# EAGLE design Lora Soil Moisture Sensor v1.2 (EAGLE 6.1)
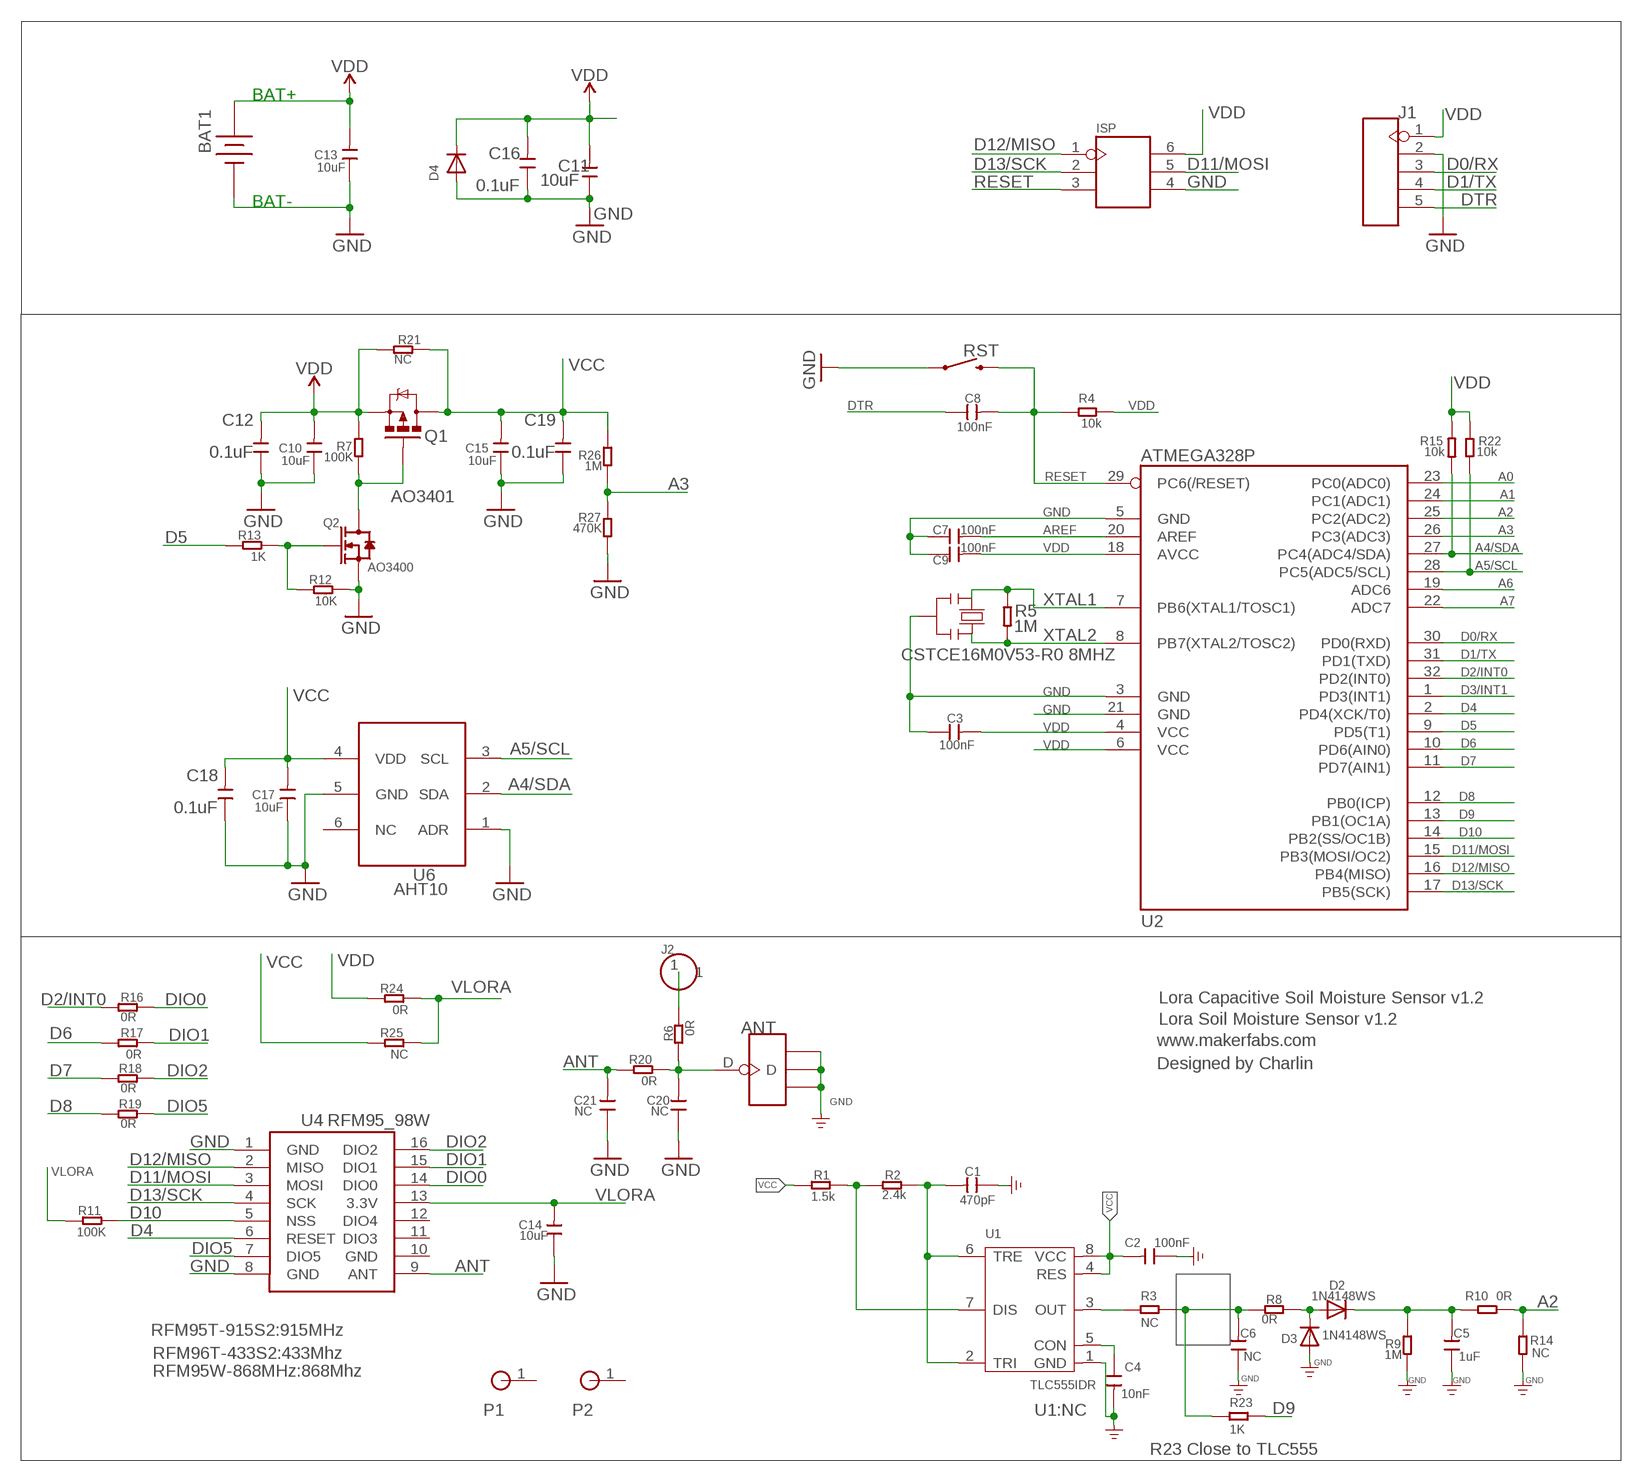
[diagram p0: schematic, sheet 1]

## Parts
ANT  ANTENNA-U-FL  [4P-U-FL]
BAT1  18650  [18650]
C1  470pF  CAP-0603  [C0603]
C2  100nF  CAP-0603  [C0603]
C3  100nF  C-0603  [0603]
C4  10nF  CAP-0603  [C0603]
C5  1uF  DISCRETE_C-0603  [DISCRETE_C0603]
C6  NC  DISCRETE_C-0603  [DISCRETE_C0603]
C7  100nF  C-0603  [0603]
C8  100nF  C-0603  [0603]
C9  100nF  C-0603  [0603]
C10  10uF  C-0603  [0603]
C11  10uF  C-0603  [0603]
C12  0.1uF  C-0603  [0603]
C13  10uF  C-0603  [0603]
C14  10uF  C-0603  [0603]
C15  10uF  C-0603  [0603]
C16  0.1uF  C-0603  [0603]
C17  10uF  C-0603  [0603]
C18  0.1uF  C-0603  [0603]
C19  0.1uF  C-0603  [0603]
C20  NC  C-0603  [0603]
C21  NC  C-0603  [0603]
D2  1N4148WS  DIODESOD-323F  [SOD-323F]
D3  1N4148WS  DIODESOD-323F  [SOD-323F]
D4  DIODESOD-323F  [SOD-323F]
ISP  HEADER-2X3P-SMD  [2X3P-2.54-SMD]
J1  HEADER-5P-2.54  [5P-2.54]
J2  HEADER-1P-50  [1P-100/50MIL]
P1  HOLE-P1-2.2  [MTGNP1-220-1MM]
P2  HOLE-P1-2.2  [MTGNP1-220-1MM]
Q1  MOSFET-PCHANNEL  [SOT23-3]
Q2  AO3400  DISCRETE_MOSFET-NSOT23  [DISCRETE_SOT23]
R1  1.5k  RES-0603  [R0603]
R2  2.4k  RES-0603  [R0603]
R3  NC  RES-0603  [R0603]
R4  10k  R-0603  [R0603]
R5  1M  R-0603  [R0603]
R6  0R  R-0603  [R0603]
R7  100K  R-0603  [R0603]
R8  0R  R-0603  [R0603]
R9  1M  R-0603  [R0603]
R10  0R  R-0603  [R0603]
R11  100K  R-0603  [R0603]
R12  10K  R-0603  [R0603]
R13  1K  R-0603  [R0603]
R14  NC  R-0603  [R0603]
R15  10k  R-0603  [R0603]
R16  0R  R-0603  [R0603]
R17  0R  R-0603  [R0603]
R18  0R  R-0603  [R0603]
R19  0R  R-0603  [R0603]
R20  0R  R-0603  [R0603]
R21  NC  R-0603  [R0603]
R22  10k  R-0603  [R0603]
R23  1K  RES-0603  [R0603]
R24  0R  R-0603  [R0603]
R25  NC  R-0603  [R0603]
R26  1M  R-0603  [R0603]
R27  470K  R-0603  [R0603]
RST  MOMENTARY-SWITCH-SPST-SMD-6.0X3.5MM  [TACTILE_SWITCH_SMD_6.0X3.5MM]
U1  TLC555IDR  CLOCK/TIMING-NE555'DR'  [SOIC8-1.27-5X4MM]
U2  ATMEGA328P  ATMEGA8/168/328  [TQFP32]
U4  RFM95_98W  RFM92_93W  [RFM92_93W]
U6  AHT10  [SMD6-127P-400L500W]
Y1  CSTCE16M0V53-R0 8MHZ  RESONATORMU  [RESONATOR]

## Nets
A0: U2.23(PC0(ADC0))
A1: U2.24(PC1(ADC1))
A2: R10.2 R14.1 U2.25(PC2(ADC2))
A3: R26.1 R27.2 U2.26(PC3(ADC3))
A4/SDA: R15.2 U2.27(PC4(ADC4/SDA)) U6.2(SDA)
A5/SCL: R22.2 U2.28(PC5(ADC5/SCL)) U6.3(SCL)
A6: U2.19(ADC6)
A7: U2.22(ADC7)
ANT: C21.2 R20.2 U4.9(ANT)
AREF: C7.2 U2.20(AREF)
D0/RX: J1.3 U2.30(PD0(RXD))
D1/TX: J1.4 U2.31(PD1(TXD))
D2/INT0: R16.1 U2.32(PD2(INT0))
D3/INT1: U2.1(PD3(INT1))
D4: U2.2(PD4(XCK/T0)) U4.6(RESET)
D5: R13.2 U2.9(PD5(T1))
D6: R17.1 U2.10(PD6(AIN0))
D7: R18.1 U2.11(PD7(AIN1))
D8: R19.1 U2.12(PB0(ICP))
D9: R23.2 U2.13(PB1(OC1A))
D10: R11.1 U2.14(PB2(SS/OC1B)) U4.5(NSS)
D11/MOSI: ISP.5 U2.15(PB3(MOSI/OC2)) U4.3(MOSI)
D12/MISO: ISP.1 U2.16(PB4(MISO)) U4.2(MISO)
D13/SCK: ISP.2 U2.17(PB5(SCK)) U4.4(SCK)
DIO0: R16.2 U4.14(DIO0)
DIO1: R17.2 U4.15(DIO1)
DIO2: R18.2 U4.16(DIO2)
DIO5: R19.2 U4.7(DIO5)
DTR: C8.1 J1.5
GND: ANT.GND1 ANT.GND2 ANT.GND3 BAT1.2 C1.1 C2.1 C3.1 C4.2 C5.1 C6.1 C7.1 C9.1 C10.1 C11.1 C12.1 C13.1 C14.1 C15.1 C16.1 C17.1 C18.1 C19.1 C20.1 C21.1 D3.A D4.A ISP.4 J1.2 Q2.2(S) R9.1 R12.1 R14.2 R27.1 RST.1 U1.1(GND) U2.3(GND) U2.5(GND) U2.21(GND) U4.1(GND) U4.8(GND) U6.1(ADR) U6.5(GND) Y1.2
N$1: R1.1 R2.2 U1.7(DIS)
N$2: C1.2 R2.1 U1.2(TRI) U1.6(TRE)
N$3: C4.1 U1.5(CON)
N$4: R3.1 U1.3(OUT)
N$5: C6.2 R3.2 R8.1 R23.1
N$6: J2.1 R6.1
N$8: Q1.1(G) Q2.3(D) R7.1
N$9: D2.A D3.C R8.2
N$10: Q2.1(G) R12.2 R13.1
N$11: C5.2 D2.C R9.2 R10.1
N$12: ANT.D C20.2 R6.2 R20.1
RESET: C8.2 ISP.3 R4.2 RST.2 U2.29(PC6(/RESET))
VCC: C2.2 C15.2 C17.2 C18.2 C19.2 Q1.3(D) R1.2 R21.1 R25.2 R26.2 U1.4(RES) U1.8(VCC) U6.4(VDD)
VDD: BAT1.1 C3.2 C9.2 C10.2 C11.2 C12.2 C13.2 C16.2 D4.C ISP.6 J1.1 Q1.2(S) R4.1 R7.2 R15.1 R21.2 R22.1 R24.2 U2.4(VCC) U2.6(VCC) U2.18(AVCC)
VLORA: C14.2 R11.2 R24.1 R25.1 U4.13(3.3V)
XTAL1: R5.2 U2.7(PB6(XTAL1/TOSC1)) Y1.1
XTAL2: R5.1 U2.8(PB7(XTAL2/TOSC2)) Y1.3
Unconnected: P1.1 P2.1 U4.11(DIO3) U4.12(DIO4) U6.6(NC)

## Notes on the sheet
- BAT+
- BAT-
- AO3401
- Lora Capacitive Soil Moisture Sensor v1.2
- Lora Soil Moisture Sensor v1.2
- www.makerfabs.com
- Designed by Charlin
- RFM95T-915S2:915MHz
- RFM96T-433S2:433Mhz
- RFM95W-868MHz:868Mhz
- U1:NC
- R23 Close to TLC555

## Power pins joined to a net without a drawn wire
GND: U4.10(GND)

## Library data of the parts
ANT = Connector:ANTENNA-U-FL
BAT1 = BAT:18650
C1 C2 C4 = Discrete-new:CAP: Ceramic Capacitors
C3 C7-C21 = Discrete:C*: Ceramic Capacitors
C5 C6 = A9G:DISCRETE_C*: Ceramic Capacitors
D2-D4 = adafruit2:DIODE: Diode SMADIODE - SMA Surface Mount Package 20V 1A Schottky Diode Digikey: 641-1014-6-ND DO-1N4148 - Through Hole Small Current Diode SOD-123 20V 1 A (.5mV Vf) Schottky Diode - Digikey: MBRX120TPMSCT-ND SOD-323 10V 570mA (.38mV Vf, 3ns) Schottky Diode - Digikey: ZLLS410CT-ND SOD-523 30V 30mA Schottky Diode (RB751S-40TE61) - Digikey: RB751S-40TE61CT-ND SOT23-R/W - SOT23 Package (R = Solder Paste/Reflow Ovens, W = Hand-Soldering) BAT54Film 40V 300mA - Digikey: 497-7162-1-ND
ISP = Connector:HEADER-2X3P
J1 = Connector:HEADER-5P
J2 = Connector:HEADER-1P
P1 P2 = self:HOLE-P1-2.2
Q1 = User-Submitted:MOSFET-PCHANNEL: Generic PMOSFET IRLML2244 - TRANS-11153 (SOT-23 -20V -4.3A) (1.Gate 2.Source 3.Drain) FQP27P06 - COM-10349 <http://www.sparkfun.com/products/10349> (TO-220 -60V -27A) (1.Gate 2.Source 3.Drain); PROD_ID: TRANS-08285
Q2 = A9G:DISCRETE_MOSFET-N: IRLL014: http://www.vishay.com/docs/91319/sihll014.pdf
R1-R3 R23 = Discrete-new:RES
R4-R22 R24-R27 = Discrete:R*
RST = SparkFun-Switches:MOMENTARY-SWITCH-SPST: Momentary Switch (Pushbutton) - SPST Normally-open (NO) SPST momentary switches (buttons, pushbuttons). Variants PTH-12MM - 12mm square, through-hole Momentary Pushbutton Switch - 12mm Square <https://www.sparkfun.com/products/9190> (COM-09190) PTH-6.0MM, PTH-6.0MM-KIT - 6.0mm square, through-hole Mini Pushbutton Switch <https://www.sparkfun.com/products/97> (COM-00097) KIT package intended for soldering kit's - only one side of pads' copper is exposed. PTH-RIGHT-ANGLE-KIT - Right-angle, through-hole Right Angle Tactile Button <https://www.sparkfun.com/products/10791> - Used on SparkFun BigTime Watch Kit <https://www.sparkfun.com/products/11734> SMD-12MM - 12mm square, surface-mount Tactile Button - SMD (12mm) <https://www.sparkfun.com/products/12993> (COM-12993) Used on SparkFun PicoBoard <https://www.sparkfun.com/products/11888> SMD-4.5MM - 4.5mm Square Trackball Switch Used on SparkFun Blackberry Trackballer Breakout <https://www.sparkfun.com/products/13169> SMD-4.6MMX2.8MM - 4.60mm x 2.80mm, surface mount Used on SparkFun SAMD21 Mini Breakout <https://www.sparkfun.com/products/13664> SMD-5.2MM, SMD-5.2-REDUNDANT - 5.2mm square, surface-mount Mini Pushbutton Switch - SMD <https://www.sparkfun.com/products/8720> (COM-08720) Used on Arduino Pro Mini <https://www.sparkfun.com/products/11114> REDUNDANT package connects both switch circuits together SMD-6.0X3.5MM - 6.0 x 3.5mm, surface mount Momentary Reset Switch SMD <https://www.sparkfun.com/products/8229> (COM-08229) SMD-6.2MM-TALL - 6.2mm square, surface mount Tactile Button - SMD (6mm) <https://www.sparkfun.com/products/12992> Used on SparkFun Digital Sandbox <https://www.sparkfun.com/products/12651> SMD-RIGHT-ANGLE - Right-angle, surface mount Used on SparkFun Block for Intel® Edison - Arduino <https://www.sparkfun.com/products/13036>; PROD_ID: SWCH-00815; SF_SKU: COM-08229
U1 = IC-new:CLOCK/TIMING-NE555: DIP-8:310110001;SOIC-8:310110013;TSSOP-8:310110002
U2 = IC:ATMEGA8/168/328: MICROCONTROLLER
U4 = dragino:RFM92_93W
U6 = self:AHT10
Y1 = SmartPrj:RESONATOR

## Net classes
0 default: width 0.152 mm, drill 0.305 mm, clearance 0.152 mm

## Board
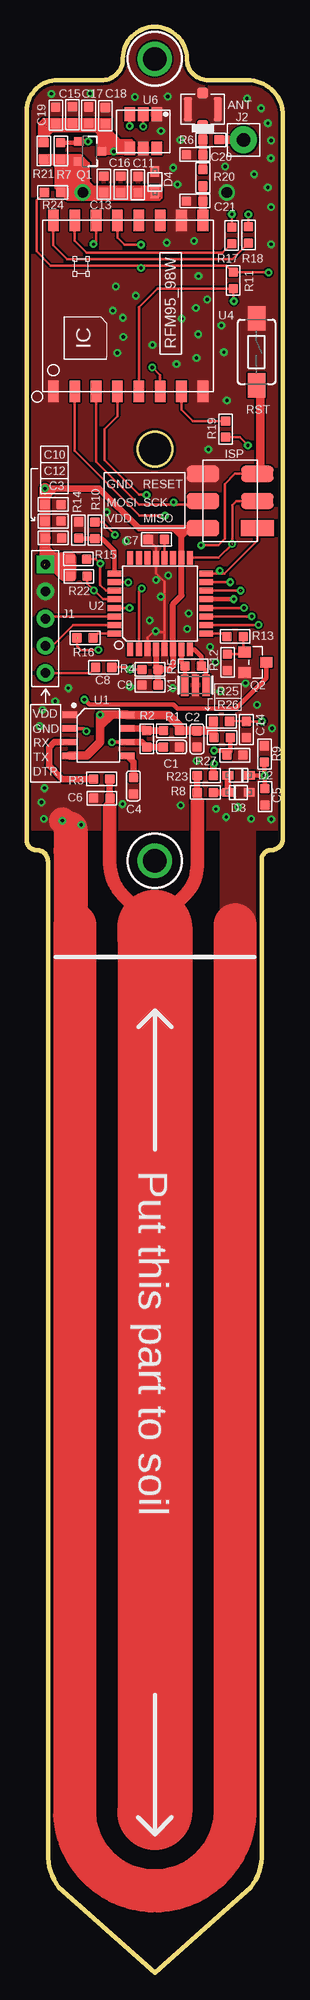
[diagram p1: board, top side]
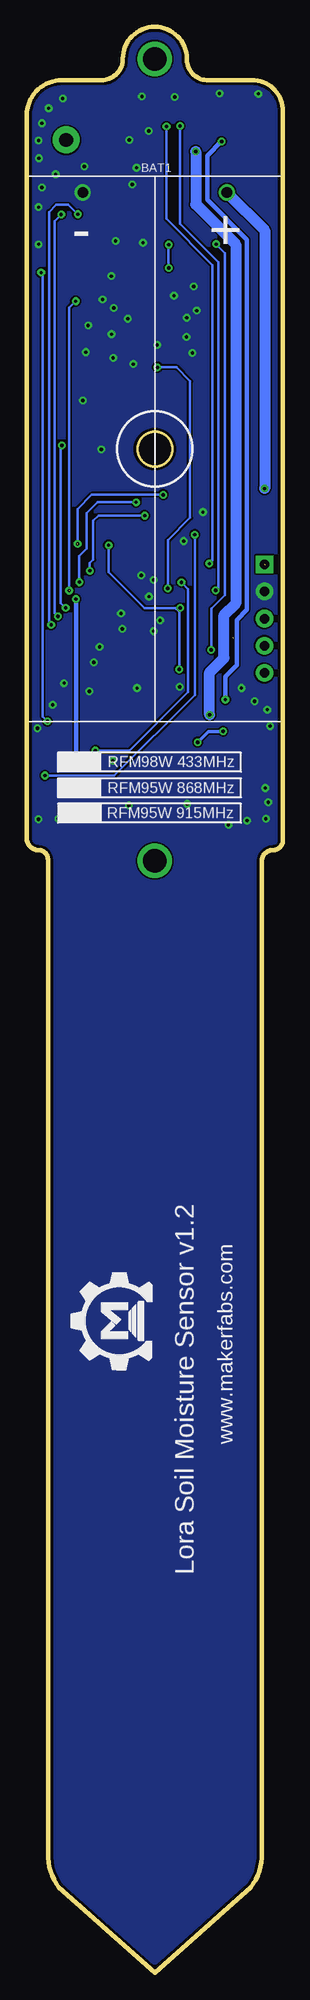
[diagram p2: board, bottom side, seen from below]

Size 24 x 182 mm. Coordinates in mm from the lower left corner, seen from the top.
Outline: 12,0 3,8 arc-38 1.99,11.18 1.99,103.94 arc90 0.93,105 arc-90 0,105.93 0,174.1 arc-90 2.9,177 7,177 arc90 9,178.89 9,179 arc-180 15,179 arc90 17,177 20.7,177 arc-90 24,173.7 24,106.11 arc-90 22.89,105 arc90 22.01,104.12 22.01,11.18 arc-38 21,8 12,0
Outline: circle at 12,142.5 radius 1.6
Copper layers (1*16): Top 0.035mm / dielectric 1.5mm / Bottom 0.035mm
Design rules: minimum track width 10mil, minimum drill 12mil, track to track 6mil, track to pad 6mil, pad to pad 6mil, via to via 6mil, smd to smd 0mil, copper to edge 10mil, drill to drill 10mil, minimum pad ring 10mil, minimum via ring 8mil, stop-mask expansion 4mil, vias tented up to drill 100mil, thermal gap 0mil

### Footprints (pad centres in the part's own frame; a part is rotated, then mirrored left to right if it is on the bottom)
4P-U-FL = smd 1.016 x 1.016: D -1.524,0; GND3 1.524,0 | smd 2.286 x 0.762: GND1 0,1.397; GND2 0,-1.397
18650 = drill 1: 1 -6.75,-24; 2 6.75,-24
C0603 = smd 0.889 x 0.889: 1 0,0.762; 2 0,-0.762
0603 = smd 0.889 x 0.889: 1 -0.762,0; 2 0.762,0
DISCRETE_C0603 = smd 0.889 x 0.889: 1 -0.762,0; 2 0.762,0
SOD-323F = smd 1 x 0.8: A -1,0; C 1,0
2X3P-2.54-SMD = smd 3.048 x 1.524: 1 -2.54,2.54; 2 -2.54,0; 3 -2.54,-2.54; 4 2.54,-2.54; 5 2.54,0; 6 2.54,2.54
5P-2.54 = drill 0.889 pad 1.651 square: 1 0,5.08 | drill 0.889 pad 1.651: 2 0,2.54; 3 0,0; 4 0,-2.54; 5 0,-5.08
1P-100/50MIL = drill 1.27 pad 2.54: 1 0,0
MTGNP1-220-1MM = drill 2.2: 1 0,0
SOT23-3 = smd 0.8 x 0.9: 1 -0.95,-1; 2 0.95,-1; 3 0,1.1
DISCRETE_SOT23 = smd 1.016 x 1.143: 1 -0.95,-1.016; 2 0.95,-1.016; 3 0,1.016
R0603 = smd 0.889 x 0.889: 1 0,0.762; 2 0,-0.762
R0603' = smd 0.889 x 0.889: 1 -0.762,0; 2 0.762,0
TACTILE_SWITCH_SMD_6.0X3.5MM = smd 2.3 x 1.6: 1 -3.15,0; 2 3.15,0
SOIC8-1.27-5X4MM = smd 0.6 x 1.4: 1 -1.905,-2.7; 2 -0.635,-2.7; 3 0.635,-2.7; 4 1.905,-2.7; 5 1.905,2.7; 6 0.635,2.7; 7 -0.635,2.7; 8 -1.905,2.7
TQFP32 = smd 1.27 x 0.559: 1 -4.293,2.8; 2 -4.293,2; 3 -4.293,1.2; 4 -4.293,0.4; 5 -4.293,-0.4; 6 -4.293,-1.2; 7 -4.293,-2; 8 -4.293,-2.8; 17 4.293,-2.8; 18 4.293,-2; 19 4.293,-1.2; 20 4.293,-0.4; 21 4.293,0.4; 22 4.293,1.2; 23 4.293,2; 24 4.293,2.8 | smd 0.559 x 1.27: 9 -2.8,-4.293; 10 -2,-4.293; 11 -1.2,-4.293; 12 -0.4,-4.293; 13 0.4,-4.293; 14 1.2,-4.293; 15 2,-4.293; 16 2.8,-4.293; 25 2.8,4.293; 26 2,4.293; 27 1.2,4.293; 28 0.4,4.293; 29 -0.4,4.293; 30 -1.2,4.293; 31 -2,4.293; 32 -2.8,4.293
RFM92_93W = smd 2 x 1: 1 -8,7; 2 -8,5; 3 -8,3; 4 -8,1; 5 -8,-1; 6 -8,-3; 7 -8,-5; 8 -8,-7; 9 8,-7; 10 8,-5; 11 8,-3; 12 8,-1; 13 8,1; 14 8,3; 15 8,5; 16 8,7
SMD6-127P-400L500W = smd 1.27 x 1: 1 -1.6,1.27; 2 -1.6,0; 3 -1.6,-1.27; 4 1.6,-1.27; 5 1.6,0; 6 1.6,1.27
RESONATOR = smd 0.7 x 2: 1 -1,0; 2 0,0; 3 1,0

### Placement (x,y rotation side)
ANT  16.5,174.28 90 top
BAT1  12,142.5 180 bottom
C1  13.55,114.64 270 top
C2  15.95,115.4 180 top
C3  2.5,134.19 180 top
C4  9.99,111 0 top
C5  22.31,109.99 90 top
C6  7.04,109.85 0 top
C7  12.14,134.06 0 top
C8  7.2,122.09 0 top
C9  11.55,120.43 0 top
C10  2.47,137.31 180 top
C11  10.42,167.24 270 top
C12  2.47,135.76 180 top
C13  7.22,167.26 270 top
C14  20.57,116.27 90 top
C15  4.28,173.76 270 top
C16  8.81,167.25 270 top
C17  5.8,173.73 270 top
C18  7.37,173.69 270 top
C19  2.73,173.71 270 top
C20  15.74,170.04 0 top
C21  15.74,165.7 0 top
D2  19.84,111.99 0 top
D3  19.84,110.39 180 top
D4  12.01,167.48 270 top
ISP  19.06,137.64 180 top
J1  1.74,126.64 0 top
J2  20.31,171.42 0 top
P1  12,104 0 top
P2  12,179 0 top
Q1  5.88,170.33 270 top
Q2  21.42,122.56 270 top
R1  13.56,116.16 90 top
R2  11.24,115.4 180 top
R3  7.02,111.65 90 top
R4  10k  [R0603']  11.55,121.89 180 top
R5  1M  [R0603']  15.59,122.21 180 top
R6  0R  [R0603']  17.26,171.42 180 top
R7  100K  [R0603']  3.19,170.38 270 top
R8  0R  [R0603']  16.73,110.39 0 top
R9  1M  [R0603']  22.26,113.99 270 top
R10  0R  [R0603']  6.38,134.9 270 top
R11  100K  [R0603']  19.35,158.28 90 top
R12  10K  [R0603']  18.81,122.56 90 top
R13  1K  [R0603']  19.52,124.97 180 top
R14  NC  [R0603']  4.85,134.93 90 top
R15  10k  [R0603']  4.84,132.22 0 top
R16  0R  [R0603']  5.47,124.85 180 top
R17  0R  [R0603']  19.2,162.48 270 top
R18  0R  [R0603']  20.77,162.52 270 top
R19  0R  [R0603']  18.63,144.36 90 top
R20  0R  [R0603']  16.5,167.87 270 top
R21  NC  [R0603']  1.61,170.38 270 top
R22  10k  [R0603']  4.89,130.6 0 top
R23  16.72,111.97 90 top
R24  0R  [R0603']  2.42,166.5 0 top
R25  NC  [R0603']  18.25,117.04 180 top
R26  1M  [R0603']  18.3,115.52 180 top
R27  470K  [R0603']  19.49,113.87 180 top
RST  21.52,151.59 270 top
U1  6.71,115.73 270 top
U2  12.5,128.05 90 top
U4  9.5,155.89 90 top
U6  10.91,172.21 270 top
U$7  [MAKERFABS_0.3]  12.27,56.85 90 bottom
Y1  15.8,120.41 0 top

### Tracks (layer width: path | path; a pad name or v marks a point on that pad's centre or on a via)
A2
  Top 0.406: U2.25 8.21,132.98 7.05,134.14 R10.2 4.88,134.14 R14.1
A3  (via drill 0.3)
  Top 0.254: U2.26 v9.51,130.05
  Top 0.406: R26.1 19.06,114.3 | 19.06,114.3 19.06,114.2 R27.2 | v17.56,114.3 19.06,114.3
  Bottom 0.254: v9.51,130.05 8.88,129.41 8.88,119.79 14.36,114.3 v17.56,114.3
A4/SDA  (via drill 0.3)
  Top 0.254: U2.27 7.44,129.25 6.89,129.79 6.89,131.29 v6.89,131.8 6.46,132.23 5.61,132.23 R15.2 | U6.2 v10.91,172.67
  Bottom 0.254: v10.91,172.67 10.91,164.03 6.59,159.72 6.59,132.1 v6.89,131.8
A5/SCL  (via drill 0.3)
  Top 0.254: U2.28 7.15,128.45 6.34,129.26 v6.3,129.3 5.67,129.92 5.67,130.58 R22.2 | U6.3 v9.64,172.72
  Bottom 0.254: v9.64,172.72 9.64,163.6 6.03,160 6.03,129.56 v6.3,129.3
ANT
  Top 0.254: C21.2 | R20.2
  Top 0.8: U4.9 C21.2 | C21.2 R20.2
AREF
  Top 0.254: U2.20 C7.2
D0/RX
  Top 0.254: U2.30 1.94,126.85 J1.3
D1/TX
  Top 0.254: U2.31 4.37,126.05 2.42,124.1 J1.4
D2/INT0
  Top 0.254: U2.32 6.63,125.25 R16.1
D4  (via drill 0.3)
  Top 0.254: v11.76,150.15 12.5,149.41 U4.6 | U2.2 10.5,129.19 v10.78,129.47
  Bottom 0.254: v11.76,150.15 v11.75,150.14 9.99,150.14 8.7,148.84 8.7,136.07 10.78,133.99 v10.78,129.47
D5
  Top 0.254: U2.9 18.47,125.25 R13.2
D6  (via drill 0.3)
  Top 0.254: U2.10 21.7,126.05 v21.71,126.06 | R17.1 19.21,163.26 v19.21,164.47
  Bottom 0.254: v21.71,126.06 21.91,126.26 21.91,164.67 21.22,165.35 20.1,165.35 v19.21,164.47
D7  (via drill 0.3)
  Top 0.254: U2.11 v21.07,126.85 v21.08,126.85 | R18.1 20.76,163.29 v20.76,164.44
  Bottom 0.254: v21.08,126.85 21.4,127.17 21.4,163.81 v20.76,164.44
D8  (via drill 0.3)
  Top 0.254: U2.12 v20.35,127.65 | R19.1 19.97,143.6 v20.71,142.86
  Bottom 0.254: v20.35,127.65 20.81,128.12 20.81,142.75 v20.71,142.86
D9  (via drill 0.3)
  Top 0.406: v19.39,128.47 16.82,128.47 U2.13
  Top 0.61: R23.2 17.49,113 v17.56,113.08
  Bottom 0.406: v19.39,128.47 19.39,113.67 18.81,113.08 v17.56,113.08
D10  (via drill 0.3)  (1 unrouted)
  Top 0.254: U2.14 19.99,129.25 | U4.5 10.5,155.78 12.24,157.51 R11.1 19.35,156.39 v19.41,156.33
  Bottom 0.254: v20.03,129.26 20.03,155.71 v19.41,156.33
D11/MOSI  (via drill 0.3)
  Top 0.254: U2.15 19.03,130.05 v19.07,130.06 | U4.3 6.5,141.31 10.53,137.29 14,137.29 | ISP.5 16.17,137.29 14.69,137.29 14,137.29 | 14,137.29 v13.75,137.53
  Bottom 0.254: v13.75,137.53 17.37,137.53 18.4,136.5 18.4,133.2 19.09,132.51 19.09,130.08 v19.07,130.06
D12/MISO  (via drill 0.3)
  Top 0.254: U2.16 18.15,130.85 | 18.15,130.85 18.5,130.85 21.6,133.95 ISP.1 | U4.2 4.5,142.35 10.55,136.3 12.93,136.3 v12.95,136.28 | v18.09,131.13 18.09,130.91 18.15,130.85
  Bottom 0.254: v18.09,131.13 18.09,131.84 17.77,132.16 17.77,135.79 17.28,136.27 v12.96,136.27 v12.95,136.28
D13/SCK  (via drill 0.3)  (1 unrouted)
  Top 0.254: ISP.2 19.64,137.64 19.24,137.24 19.24,133.63 17.95,132.34 U2.17 | U4.4 8.5,145.6 7.28,144.37 7.28,141.48 10.5,138.25 11.19,138.25 v11.22,138.23
  Bottom 0.254: v11.22,138.23 17.92,138.23 19.24,136.91 v19.24,133.65 v19.23,133.64
DIO0  (via drill 0.3)  (1 unrouted)
  Top 0.254: U4.14 6.5,161.91 v6.26,161.67 | 4.71,124.87 4.71,124.05 5.04,123.72 v6.72,123.72
  Bottom 0.254: v6.26,161.67 5.42,160.83 5.42,128.85 6.72,127.56 v6.72,123.72
DIO1
  Top 0.254: U4.15 4.5,161.98 5.62,160.86 18.34,160.86 R17.2
DIO2
  Top 0.254: U4.16 2.5,161.57 3.8,160.27 19.28,160.27 R18.2
DIO5
  Top 0.254: U4.7 14.5,146.19 15.56,145.14 18.62,145.14 R19.2
DTR
  Top 0.254: J1.5 5.92,121.56 C8.1
GND  (via drill 0.3)
  Top 0.254: U2.5 12.9,125.37 | 12.9,125.37 12.9,130.1 12.1,130.9 U2.21 12.1,133.34 C7.1 | U2.3 11.3,124.86 11.81,125.37 12.9,125.37
  Top 2.54: v3.35,107.75 4.1,107.01 | 4.5,98 4.1,98.4 4.1,104.93
  Top 3.2: 4.1,107.01 4.1,104.93 4.1,96.5
  Top 4: 4.5,98 4.5,15.03 arc178 19.5,15.03 19.5,98
  other vias: 1.46,118.13 1.37,109.46 8.97,109.3 17.73,108.85 22.91,107.88 13.67,120.15 15.93,113.34 12.55,128.71 18.14,119.84 20.5,120.61 11.51,126.47 12.09,125.48 18.59,168.94 14.02,150.45 13.11,161.81 15.85,155.71 2.31,175.72 9.04,152.99 12.57,172.24 9.02,154.79 13.21,175.47 22.58,172.98 14.4,171.41 14.12,167.24 22.89,171.36 21.95,174.38 22.86,169.7 21.29,168.21 20.63,175.29 22.89,161.65 22.58,166.96 11.79,152.25 1.22,116.59 17.02,142.48 18.75,147.05 5.94,175.75 13.72,168.82 10.21,156.85 9.3,133.89 13.26,130.69 12.12,130.26 15.04,125.69 15.16,127.13 17.17,124.01 17.7,122.56 1.65,110.8 9.68,120.28 2.67,118.9 21.03,107.93 19.79,109.02 22.99,116.39 14.43,109.18 1.6,107.93 21.56,118.57 5.11,107.37 18.69,108.08 15.9,151.04 16.05,153.25 14.53,154.69 8.36,157.72 16.08,158.68 18.47,151.57 10.13,175.42 22.89,165.13 15.67,161.96 16.89,156.5 7.49,136.61 8.08,155.46 8.48,151.49 18.24,154.06 3.89,120.15
  pour Top: -13.4,200 -13.96,107 34.81,107 35.37,200
  pour Bottom: -13.99,200 -13.91,0 34.85,0 34.78,200
  pour Top: 21.25,107.21 21.37,107.21 21.37,93.55 17.64,93.55 17.64,98.09 18.2,98.65 18.2,106.91 18.2,107.21
N$1
  Top 0.61: U1.7 11.04,116.37 R2.2 R1.1
N$2  (via drill 0.3)
  Top 0.305: U1.2 5.33,116.37 v5.6,116.1 | v7.99,115.09 9.4,115.09 U1.6
  Top 0.61: U1.6 10.78,115.1 R2.1 C1.2
  Bottom 0.305: v5.6,116.1 6.97,116.1 v7.99,115.09
N$3
  Top 0.61: C4.1 9.99,113.24 U1.5
N$4
  Top 0.61: U1.3 2.59,115.1 2.09,114.61 2.09,112.9 3.34,111.66 R3.1
N$5
  Top 0.61: R23.1 R8.1 15.97,109.5 | R3.2 7.78,109.87 C6.2 7.78,109.84 7.78,109
  Top 1.27: 7.78,109 7.78,103.76 arc45 9.03,100.76 12,97.79 12,97.51 | 15.97,109.5 15.97,103.54 arc-45 14.86,100.86 12,98 12,96.85
  Top 7: 12,97.8 12,97.51 12,96.85 12,15
N$6
  Top 0.8: R6.1 J2.1
N$8  (via drill 0.3)
  Top 0.406: R7.1 4.74,171.15 Q1.1 5.74,171.28 v5.75,171.27 | Q2.3 22.44,121.08 19.57,118.21 14.11,118.21 13.73,118.59 5.88,118.59 v5.4,119.08
  Bottom 0.406: v5.75,171.27 7.1,169.93 7.1,165.81 3.36,162.08 3.36,127.48 4.33,126.52 4.33,122.3 5.4,121.23 v5.4,119.08
N$9
  Top 0.61: R8.2 D3.C D2.A
N$10
  Top 0.254: R13.1 20.28,123.63 Q2.1 20.22,123.32 R12.2
N$11  (via drill 0.3)
  Top 0.254: R10.1 7.09,135.67 v8.27,134.49
  Top 0.406: C5.2 22.3,111.94 v22.29,111.96 | R9.2 22.26,111.99 v22.29,111.96 | D2.C 22.26,111.99 v22.29,111.96
  Bottom 0.254: v8.27,134.49 8.27,119.51 15.81,111.96 v22.29,111.96
N$12
  Top 0.406: C20.2 | R6.2 | ANT.D
  Top 0.8: R20.1 C20.2 | C20.2 R6.2 | R6.2 ANT.D
RESET  (via drill 0.3)
  Top 0.254: U2.29 9.27,127.65 v9.63,127.65 | v16.33,133.51 | R4.2 9.74,121.89 v9.71,121.91 9.54,122.09 C8.2 | v16.33,133.51 17.95,133.51 18.58,134.14 18.58,139.24 19.52,140.18 ISP.3
  Top 0.813: ISP.3 21.88,140.46 21.88,148.08 RST.2
  Bottom 0.254: 10.12,127.65 12.98,127.65 16.33,131 v16.33,133.51 | 10.12,127.65 v9.63,127.65 | v9.71,121.91 9.71,127.25 10.12,127.65
VCC  (via drill 0.3)
  Top 0.254: U6.4 9.36,170.33 v8.16,170.33 Q1.3 | 1.18,170.81 1.18,172.97 1.54,173.33 7.86,173.33 7.86,172.29 8.75,171.4 9.84,171.4 10.02,171.22 10.02,170.1 6.69,170.1 6.67,170.13 6.67,171.96 6.39,172.24 1.46,172.24 1.36,172.14 1.36,172.9 1.64,173.18 2.78,173.18 3.01,172.95 1.64,172.95 1.54,172.85 1.54,172.39 1.51,172.36 1.51,172.47 1.87,172.82 2.22,172.82 2.7,172.34
  Top 0.305: 2.7,172.34 2.8,172.34 2.91,172.44 6.56,172.44 6.69,172.31 7.33,172.31 7.58,172.57
  Top 0.61: 7.58,172.57 7.58,170.69 7.53,170.64 9.64,170.64 9.69,170.59 9.69,171.04 8.06,171.04 8.04,171.07 8.04,171.68 7.86,171.86 7.86,171.83 8.42,171.27
  Top 0.813: v6.87,117.65 9.39,117.65 U1.8 13.28,117.64 14.33,116.6 R1.2 C2.2 17.49,116.15 | U1.4 5.61,113.83 6.87,115.09 v6.87,117.65 | 7.91,117.63 7.88,117.63 6.97,116.71 6.97,117.55 v6.87,117.65 | R21.1 1.61,171.83 C19.2 3.01,172.95 4.23,172.95 C15.2 5.77,173 C17.2 6.87,172.97 | 6.87,172.97 7.33,172.97 C18.2 | Q1.3 6.98,172.86 6.87,172.97 | R26.2 17.49,115.57 17.49,116.15 | 17.49,116.15 R25.2
  Bottom 1.016: v8.16,170.33 8.16,165.38 4.43,161.65 4.43,128.07 5.52,126.97 5.52,122.96 6.87,121.61 v6.87,117.65
VDD  (via drill 0.3)  (1 unrouted)
  Top 0.254: BAT1.1 C13.2 | C13.2 | C13.2 8.79,166.5 C16.2 C11.2 D4.C | 1.21,169.98 1.21,169.27 1.31,169.16 2.53,169.16 2.73,168.96 2.73,166.9 3.8,165.84 12.46,165.84 12.61,165.99 12.61,166.83 12.41,167.03 6.29,167.03 5.8,167.51 5.8,167.97 | 5.8,167.97 5.8,169.06 | 5.8,169.06 4.89,169.98 1.21,169.98 | 1.21,169.98 1.76,169.42 2.5,169.42 2.8,169.11 3.44,169.11 | 3.95,167.82 4.1,167.97 5.8,167.97 | 5.8,169.06 5.8,169.24 5.07,169.98 4.63,169.98 4.61,169.95
  Top 0.55: 14.5,134.58 U2.18 14.5,128.82 13.7,128.02 U2.6 13.7,122.27 13.32,121.89 R4.1 | U2.4 12.1,122.1 R4.1
  Top 0.61: 14.5,134.58 15.02,135.1 | 15.02,135.1 10.5,135.1 6.79,138.81 v1.71,138.81 | C9.2 R4.1 | 2.63,138.79 1.71,137.87 C10.2 | ISP.6 15.2,135.1 | 15.2,135.1 15.02,135.1 | 14.46,134.39 13.78,135.08 | 13.78,135.08 13.75,135.08 | 13.78,135.08 15.2,135.08 | 15.89,135.08 15.2,135.08 | 15.2,135.08 14.49,134.37 | 15.2,135.08 15.2,135.1
  Top 0.813: R21.2 R7.2 | R7.2 3.19,168.38 | 3.19,168.38 R24.2 3.19,167.06 3.92,166.32 12.18,166.32 12.2,166.29 12.2,166.55 12.25,166.6 5.98,166.6 5.42,167.16 5.42,168.86 5.4,168.88 4.71,168.88 4.63,168.96 3.59,168.96 3.44,169.11 | R7.2 4.64,169.62 Q1.2 5.25,169.01 BAT1.1 | 3.19,168.38 3.29,168.28 4.53,168.28 4.63,168.17 4.63,166.85 4.61,166.88 3.92,166.88 3.95,166.9 3.95,167.82 | R22.1 4.12,131.55 | 4.12,131.55 4.12,132.18 R15.1 | J1.1 3.95,131.72 4.12,131.55 | 1.66,131.65 2.37,131.65 3.52,130.5 4.28,130.5 4.28,132.33 4.18,132.44 2.5,132.44 1.79,133.15 1.79,132.33 2.02,132.1 2.65,132.1 3.62,131.14 3.85,131.14 4.02,131.32
  Top 1.016: J1.1 1.71,131.75 C12.2 | v1.71,138.81 C10.2 C12.2 | C3.2 1.71,134.21 C12.2
  Bottom 1.016: BAT1.1 1.71,162.96 v1.71,138.81
VLORA  (via drill 0.3)
  Top 0.254: U4.13 8.5,162.28 9.15,161.62 v10.71,161.62 | R25.1 C14.2 v22.05,117.04 v22.06,117.04 | 10.73,159.66 2.25,159.66 0.93,160.99 0.93,165.79 1.64,166.5 R24.1 | 10.73,159.66 18.72,159.66 R11.2 22.61,159.04 v22.64,159 | v10.71,159.44 10.71,159.64 10.73,159.66
  Bottom 0.254: v22.06,117.04 22.49,117.47 22.49,158.85 v22.64,159 | v10.71,161.62 v10.71,159.44
XTAL1
  Top 0.406: U2.7 14.5,122.54 R5.2 14.83,120.44 Y1.1
XTAL2
  Top 0.406: U2.8 15.7,123.76 16.37,123.09 16.37,122.22 R5.1 16.8,121.76 Y1.3

### Text on the board
tPlace: U4 | GND | RESET | MOSI | SCK | VDD | MISO | VDD | GND | RX | TX | DTR | Put this part to soil
bPlace: BAT1 | RFM98W 433MHz | RFM95W 868MHz | RFM95W 915MHz | www.makerfabs.com | Lora Soil Moisture Sensor v1.2